# EAGLE schematic riffleBoost-REVA (EAGLE 6.5.0)
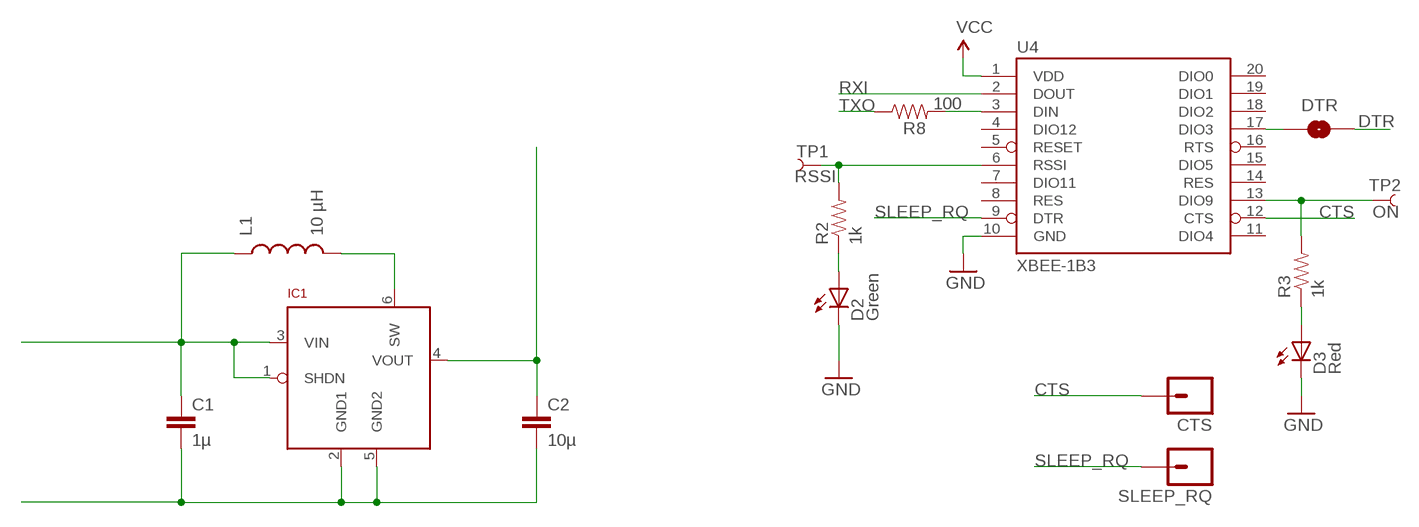
[diagram p0: schematic, sheet 1]

## Parts
C1  1µ  CAP0603-CAP  [0603-CAP]
C2  10µ  CAP0805  [0805]
CTS  M01PTH  [1X01]
D2  Green  LED0603  [LED-0603]
D3  Red  LED0603  [LED-0603]
DTR  SOLDERJUMPERNC  [SJ_2S]
IC1  LTC3525  [SC70]
L1  10 µH  INDUCTOR1210  [1210]
R2  1k  RESISTOR0402-RES  [0402-RES]
R3  1k  RESISTOR0402-RES  [0402-RES]
R8  100  RESISTOR0402-RES  [0402-RES]
SLEEP_RQ  M01PTH  [1X01]
TP1  RSSI  TEST-POINT3X5  [PAD.03X.05]
TP2  ON  TEST-POINT3X5  [PAD.03X.05]
U4  XBEE-1B3  [XBEE-SMD]

## Nets
CTS: CTS.1 U4.12(CTS)
DTR: DTR.2
GND [VCC]: C1.2 C2.2 D2.C D3.C IC1.2(GND1) IC1.5(GND2) U4.10(GND)
N$1 [VCC]: C1.1 IC1.1(SHDN) IC1.3(VIN) L1.1
N$2: R2.2 TP1.P$1 U4.6(RSSI)
N$3: D2.A R2.1
N$4 [VCC]: IC1.6(SW) L1.2
N$5: R3.2 TP2.P$1 U4.13(DIO9)
N$6: D3.A R3.1
N$7: R8.2 U4.3(DIN)
N$13: DTR.1 U4.17(DIO3)
RXI: U4.2(DOUT)
SLEEP_RQ: SLEEP_RQ.1 U4.9(DTR)
TXO: R8.1
VCC [VCC]: C2.1 IC1.4(VOUT) U4.1(VDD)
Unconnected: U4.4(DIO12) U4.5(RESET) U4.7(DIO11) U4.8(RES) U4.11(DIO4) U4.14(RES) U4.15(DIO5) U4.16(RTS) U4.18(DIO2) U4.19(DIO1) U4.20(DIO0)

## Library data of the parts
C1 C2 = SparkFun:CAP: Capacitor Standard 0603 ceramic capacitor, and 0.1" leaded capacitor.
CTS SLEEP_RQ = SparkFun:M01: Header 1 Standard 1-pin 0.1" header. Use with straight break away headers (SKU : PRT-00116), right angle break away headers (PRT-00553), swiss pins (PRT-00743), machine pins (PRT-00117), and female headers (PRT-00115).
D2 D3 = SparkFun:LED: LEDs Standard schematic elements and footprints for 5mm, 3mm, 1206, and 0603 sized LEDs. 5mm - Spark Fun Electronics SKU : COM-00529 (and others)
DTR = SparkFun:SOLDERJUMPER: Solder Jumper Standard SMD solder jumper. Used to automate production. Two varients : Normally Open and Normally Closed are the same, but have different paste layers. NC will have a large amount of paste and should jumper during reflow.
IC1 = JeeLabs:LTC3525
L1 = SparkFun:INDUCTOR: Inductors Basic Inductor/Choke - 0603 and 1206. Footprints are not proven and vary greatly between part numbers.
R2 R3 R8 = SparkFun:RESISTOR: Resistor Basic schematic elements and footprints for 0603, 1206, and PTH resistors.
TP1 TP2 = SparkFun:TEST-POINT
U4 = SparkFun:XBEE-1

## Net classes
0 Default: width 0.203 mm
1 VCC: width 0.381 mm